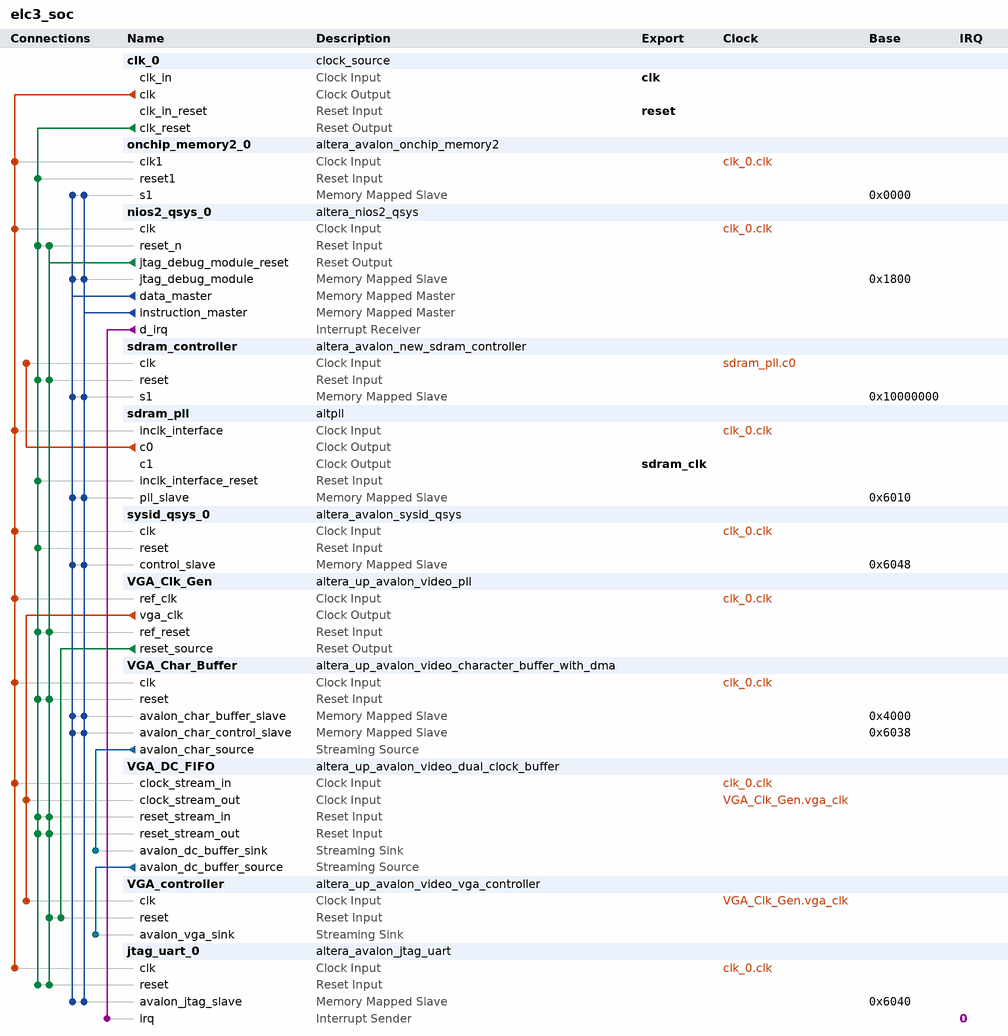
[diagram p0: system contents]
# Platform Designer (Qsys) system elc3_soc, Cyclone IV E EP4CE115F29C7
# Parameters at their usual value, and those the tool derives, are not listed.
package require -exact qsys 15.0
create_system elc3_soc
set_project_property DEVICE_FAMILY {Cyclone IV E}
set_project_property DEVICE EP4CE115F29C7

add_instance clk_0 clock_source 15.0
set_instance_parameter_value clk_0 clockFrequency 50000000

add_instance onchip_memory2_0 altera_avalon_onchip_memory2 15.0
set_instance_parameter_value onchip_memory2_0 dataWidth 32
set_instance_parameter_value onchip_memory2_0 dualPort false
set_instance_parameter_value onchip_memory2_0 initMemContent true
set_instance_parameter_value onchip_memory2_0 initializationFileName onchip_mem.hex
set_instance_parameter_value onchip_memory2_0 memorySize 4096

add_instance nios2_qsys_0 altera_nios2_qsys 15.0
set_instance_parameter_value nios2_qsys_0 breakSlave nios2_qsys_0.jtag_debug_module
set_instance_parameter_value nios2_qsys_0 exceptionSlave sdram_controller.s1
set_instance_parameter_value nios2_qsys_0 icache_size 4096
set_instance_parameter_value nios2_qsys_0 impl Tiny
set_instance_parameter_value nios2_qsys_0 mmu_TLBMissExcSlave None
set_instance_parameter_value nios2_qsys_0 resetSlave sdram_controller.s1
set_instance_parameter_value nios2_qsys_0 resetrequest_enabled true

add_instance sdram_controller altera_avalon_new_sdram_controller 15.0
set_instance_parameter_value sdram_controller TAC 5.5
set_instance_parameter_value sdram_controller TRCD 20.0
set_instance_parameter_value sdram_controller TRP 20.0
set_instance_parameter_value sdram_controller casLatency 3
set_instance_parameter_value sdram_controller columnWidth 10
set_instance_parameter_value sdram_controller dataWidth 32
set_instance_parameter_value sdram_controller generateSimulationModel false
set_instance_parameter_value sdram_controller model single_Micron_MT48LC4M32B2_7_chip
set_instance_parameter_value sdram_controller numberOfBanks 4
set_instance_parameter_value sdram_controller numberOfChipSelects 1
set_instance_parameter_value sdram_controller powerUpDelay 200.0
set_instance_parameter_value sdram_controller refreshPeriod 7.8125
set_instance_parameter_value sdram_controller rowWidth 13

add_instance sdram_pll altpll 15.0
set_instance_parameter_value sdram_pll CLK0_DIVIDE_BY 1
set_instance_parameter_value sdram_pll CLK0_MULTIPLY_BY 1
set_instance_parameter_value sdram_pll CLK1_DIVIDE_BY 1
set_instance_parameter_value sdram_pll CLK1_DUTY_CYCLE 50
set_instance_parameter_value sdram_pll CLK1_MULTIPLY_BY 1
set_instance_parameter_value sdram_pll CLK1_PHASE_SHIFT -3000
set_instance_parameter_value sdram_pll CLK2_DIVIDE_BY 2
set_instance_parameter_value sdram_pll CLK2_DUTY_CYCLE 50
set_instance_parameter_value sdram_pll CLK2_MULTIPLY_BY 1
set_instance_parameter_value sdram_pll CLK2_PHASE_SHIFT 0
set_instance_parameter_value sdram_pll INCLK0_INPUT_FREQUENCY 20000
set_instance_parameter_value sdram_pll PORT_ARESET PORT_USED
set_instance_parameter_value sdram_pll PORT_LOCKED PORT_USED
set_instance_parameter_value sdram_pll PORT_clk1 PORT_USED
set_instance_parameter_value sdram_pll PORT_clk2 PORT_USED
set_instance_parameter_value sdram_pll PORT_clk3 PORT_UNUSED

add_instance sysid_qsys_0 altera_avalon_sysid_qsys 15.0
set_instance_parameter_value sysid_qsys_0 id 0

add_instance VGA_Clk_Gen altera_up_avalon_video_pll 15.0
set_instance_parameter_value VGA_Clk_Gen camera {5MP Digital Camera}
set_instance_parameter_value VGA_Clk_Gen gui_refclk 50.0
set_instance_parameter_value VGA_Clk_Gen lcd {7" LCD on VEEK-MT and MTL Module}
set_instance_parameter_value VGA_Clk_Gen lcd_clk_en true
set_instance_parameter_value VGA_Clk_Gen video_in_clk_en true

add_instance VGA_Char_Buffer altera_up_avalon_video_character_buffer_with_dma 15.0
set_instance_parameter_value VGA_Char_Buffer enable_transparency false

add_instance VGA_DC_FIFO altera_up_avalon_video_dual_clock_buffer 15.0
set_instance_parameter_value VGA_DC_FIFO color_bits 10

add_instance VGA_controller altera_up_avalon_video_vga_controller 15.0
set_instance_parameter_value VGA_controller board DE1-SoC
set_instance_parameter_value VGA_controller resolution {VGA 640x480}

add_instance jtag_uart_0 altera_avalon_jtag_uart 15.0
set_instance_parameter_value jtag_uart_0 simInteractiveOptions NO_INTERACTIVE_WINDOWS

# connections
add_connection clk_0.clk jtag_uart_0.clk clock
add_connection clk_0.clk nios2_qsys_0.clk clock
add_connection clk_0.clk onchip_memory2_0.clk1 clock
add_connection clk_0.clk sdram_pll.inclk_interface clock
add_connection clk_0.clk sysid_qsys_0.clk clock
add_connection clk_0.clk VGA_Char_Buffer.clk clock
add_connection clk_0.clk VGA_Clk_Gen.ref_clk clock
add_connection clk_0.clk VGA_DC_FIFO.clock_stream_in clock
add_connection sdram_pll.c0 sdram_controller.clk clock
add_connection VGA_Clk_Gen.vga_clk VGA_controller.clk clock
add_connection VGA_Clk_Gen.vga_clk VGA_DC_FIFO.clock_stream_out clock
add_connection clk_0.clk_reset jtag_uart_0.reset reset
add_connection clk_0.clk_reset nios2_qsys_0.reset_n reset
add_connection clk_0.clk_reset onchip_memory2_0.reset1 reset
add_connection clk_0.clk_reset sdram_controller.reset reset
add_connection clk_0.clk_reset sdram_pll.inclk_interface_reset reset
add_connection clk_0.clk_reset sysid_qsys_0.reset reset
add_connection clk_0.clk_reset VGA_Char_Buffer.reset reset
add_connection clk_0.clk_reset VGA_Clk_Gen.ref_reset reset
add_connection clk_0.clk_reset VGA_DC_FIFO.reset_stream_in reset
add_connection clk_0.clk_reset VGA_DC_FIFO.reset_stream_out reset
add_connection nios2_qsys_0.jtag_debug_module_reset jtag_uart_0.reset reset
add_connection nios2_qsys_0.jtag_debug_module_reset nios2_qsys_0.reset_n reset
add_connection nios2_qsys_0.jtag_debug_module_reset sdram_controller.reset reset
add_connection nios2_qsys_0.jtag_debug_module_reset VGA_Char_Buffer.reset reset
add_connection nios2_qsys_0.jtag_debug_module_reset VGA_Clk_Gen.ref_reset reset
add_connection nios2_qsys_0.jtag_debug_module_reset VGA_controller.reset reset
add_connection nios2_qsys_0.jtag_debug_module_reset VGA_DC_FIFO.reset_stream_in reset
add_connection nios2_qsys_0.jtag_debug_module_reset VGA_DC_FIFO.reset_stream_out reset
add_connection VGA_Clk_Gen.reset_source VGA_controller.reset reset
add_connection nios2_qsys_0.data_master jtag_uart_0.avalon_jtag_slave avalon
set_connection_parameter_value nios2_qsys_0.data_master/jtag_uart_0.avalon_jtag_slave baseAddress 0x6040
add_connection nios2_qsys_0.data_master nios2_qsys_0.jtag_debug_module avalon
set_connection_parameter_value nios2_qsys_0.data_master/nios2_qsys_0.jtag_debug_module baseAddress 0x1800
add_connection nios2_qsys_0.data_master onchip_memory2_0.s1 avalon
set_connection_parameter_value nios2_qsys_0.data_master/onchip_memory2_0.s1 baseAddress 0x0000
add_connection nios2_qsys_0.data_master sdram_controller.s1 avalon
set_connection_parameter_value nios2_qsys_0.data_master/sdram_controller.s1 baseAddress 0x10000000
add_connection nios2_qsys_0.data_master sdram_pll.pll_slave avalon
set_connection_parameter_value nios2_qsys_0.data_master/sdram_pll.pll_slave baseAddress 0x6010
add_connection nios2_qsys_0.data_master sysid_qsys_0.control_slave avalon
set_connection_parameter_value nios2_qsys_0.data_master/sysid_qsys_0.control_slave baseAddress 0x6048
add_connection nios2_qsys_0.data_master VGA_Char_Buffer.avalon_char_buffer_slave avalon
set_connection_parameter_value nios2_qsys_0.data_master/VGA_Char_Buffer.avalon_char_buffer_slave baseAddress 0x4000
add_connection nios2_qsys_0.data_master VGA_Char_Buffer.avalon_char_control_slave avalon
set_connection_parameter_value nios2_qsys_0.data_master/VGA_Char_Buffer.avalon_char_control_slave baseAddress 0x6038
add_connection nios2_qsys_0.instruction_master jtag_uart_0.avalon_jtag_slave avalon
set_connection_parameter_value nios2_qsys_0.instruction_master/jtag_uart_0.avalon_jtag_slave baseAddress 0x6040
add_connection nios2_qsys_0.instruction_master nios2_qsys_0.jtag_debug_module avalon
set_connection_parameter_value nios2_qsys_0.instruction_master/nios2_qsys_0.jtag_debug_module baseAddress 0x1800
add_connection nios2_qsys_0.instruction_master onchip_memory2_0.s1 avalon
set_connection_parameter_value nios2_qsys_0.instruction_master/onchip_memory2_0.s1 baseAddress 0x0000
add_connection nios2_qsys_0.instruction_master sdram_controller.s1 avalon
set_connection_parameter_value nios2_qsys_0.instruction_master/sdram_controller.s1 baseAddress 0x10000000
add_connection nios2_qsys_0.instruction_master sdram_pll.pll_slave avalon
set_connection_parameter_value nios2_qsys_0.instruction_master/sdram_pll.pll_slave baseAddress 0x6010
add_connection nios2_qsys_0.instruction_master sysid_qsys_0.control_slave avalon
set_connection_parameter_value nios2_qsys_0.instruction_master/sysid_qsys_0.control_slave baseAddress 0x6048
add_connection nios2_qsys_0.instruction_master VGA_Char_Buffer.avalon_char_buffer_slave avalon
set_connection_parameter_value nios2_qsys_0.instruction_master/VGA_Char_Buffer.avalon_char_buffer_slave baseAddress 0x4000
add_connection nios2_qsys_0.instruction_master VGA_Char_Buffer.avalon_char_control_slave avalon
set_connection_parameter_value nios2_qsys_0.instruction_master/VGA_Char_Buffer.avalon_char_control_slave baseAddress 0x6038
add_connection VGA_Char_Buffer.avalon_char_source VGA_DC_FIFO.avalon_dc_buffer_sink avalon_streaming
add_connection VGA_DC_FIFO.avalon_dc_buffer_source VGA_controller.avalon_vga_sink avalon_streaming
add_connection nios2_qsys_0.d_irq jtag_uart_0.irq interrupt
set_connection_parameter_value nios2_qsys_0.d_irq/jtag_uart_0.irq irqNumber 0

# exported interfaces
add_interface clk clock sink
set_interface_property clk EXPORT_OF clk_0.clk_in
add_interface reset reset sink
set_interface_property reset EXPORT_OF clk_0.clk_in_reset
add_interface sdram_clk clock source
set_interface_property sdram_clk EXPORT_OF sdram_pll.c1

set_interconnect_requirement {$system} qsys_mm.clockCrossingAdapter HANDSHAKE
set_interconnect_requirement {$system} qsys_mm.enableEccProtection FALSE
set_interconnect_requirement {$system} qsys_mm.insertDefaultSlave FALSE
set_interconnect_requirement {$system} qsys_mm.maxAdditionalLatency 1

save_system elc3_soc.qsys
